# EAGLE design CalibratorDevice (EAGLE 7.7.0)
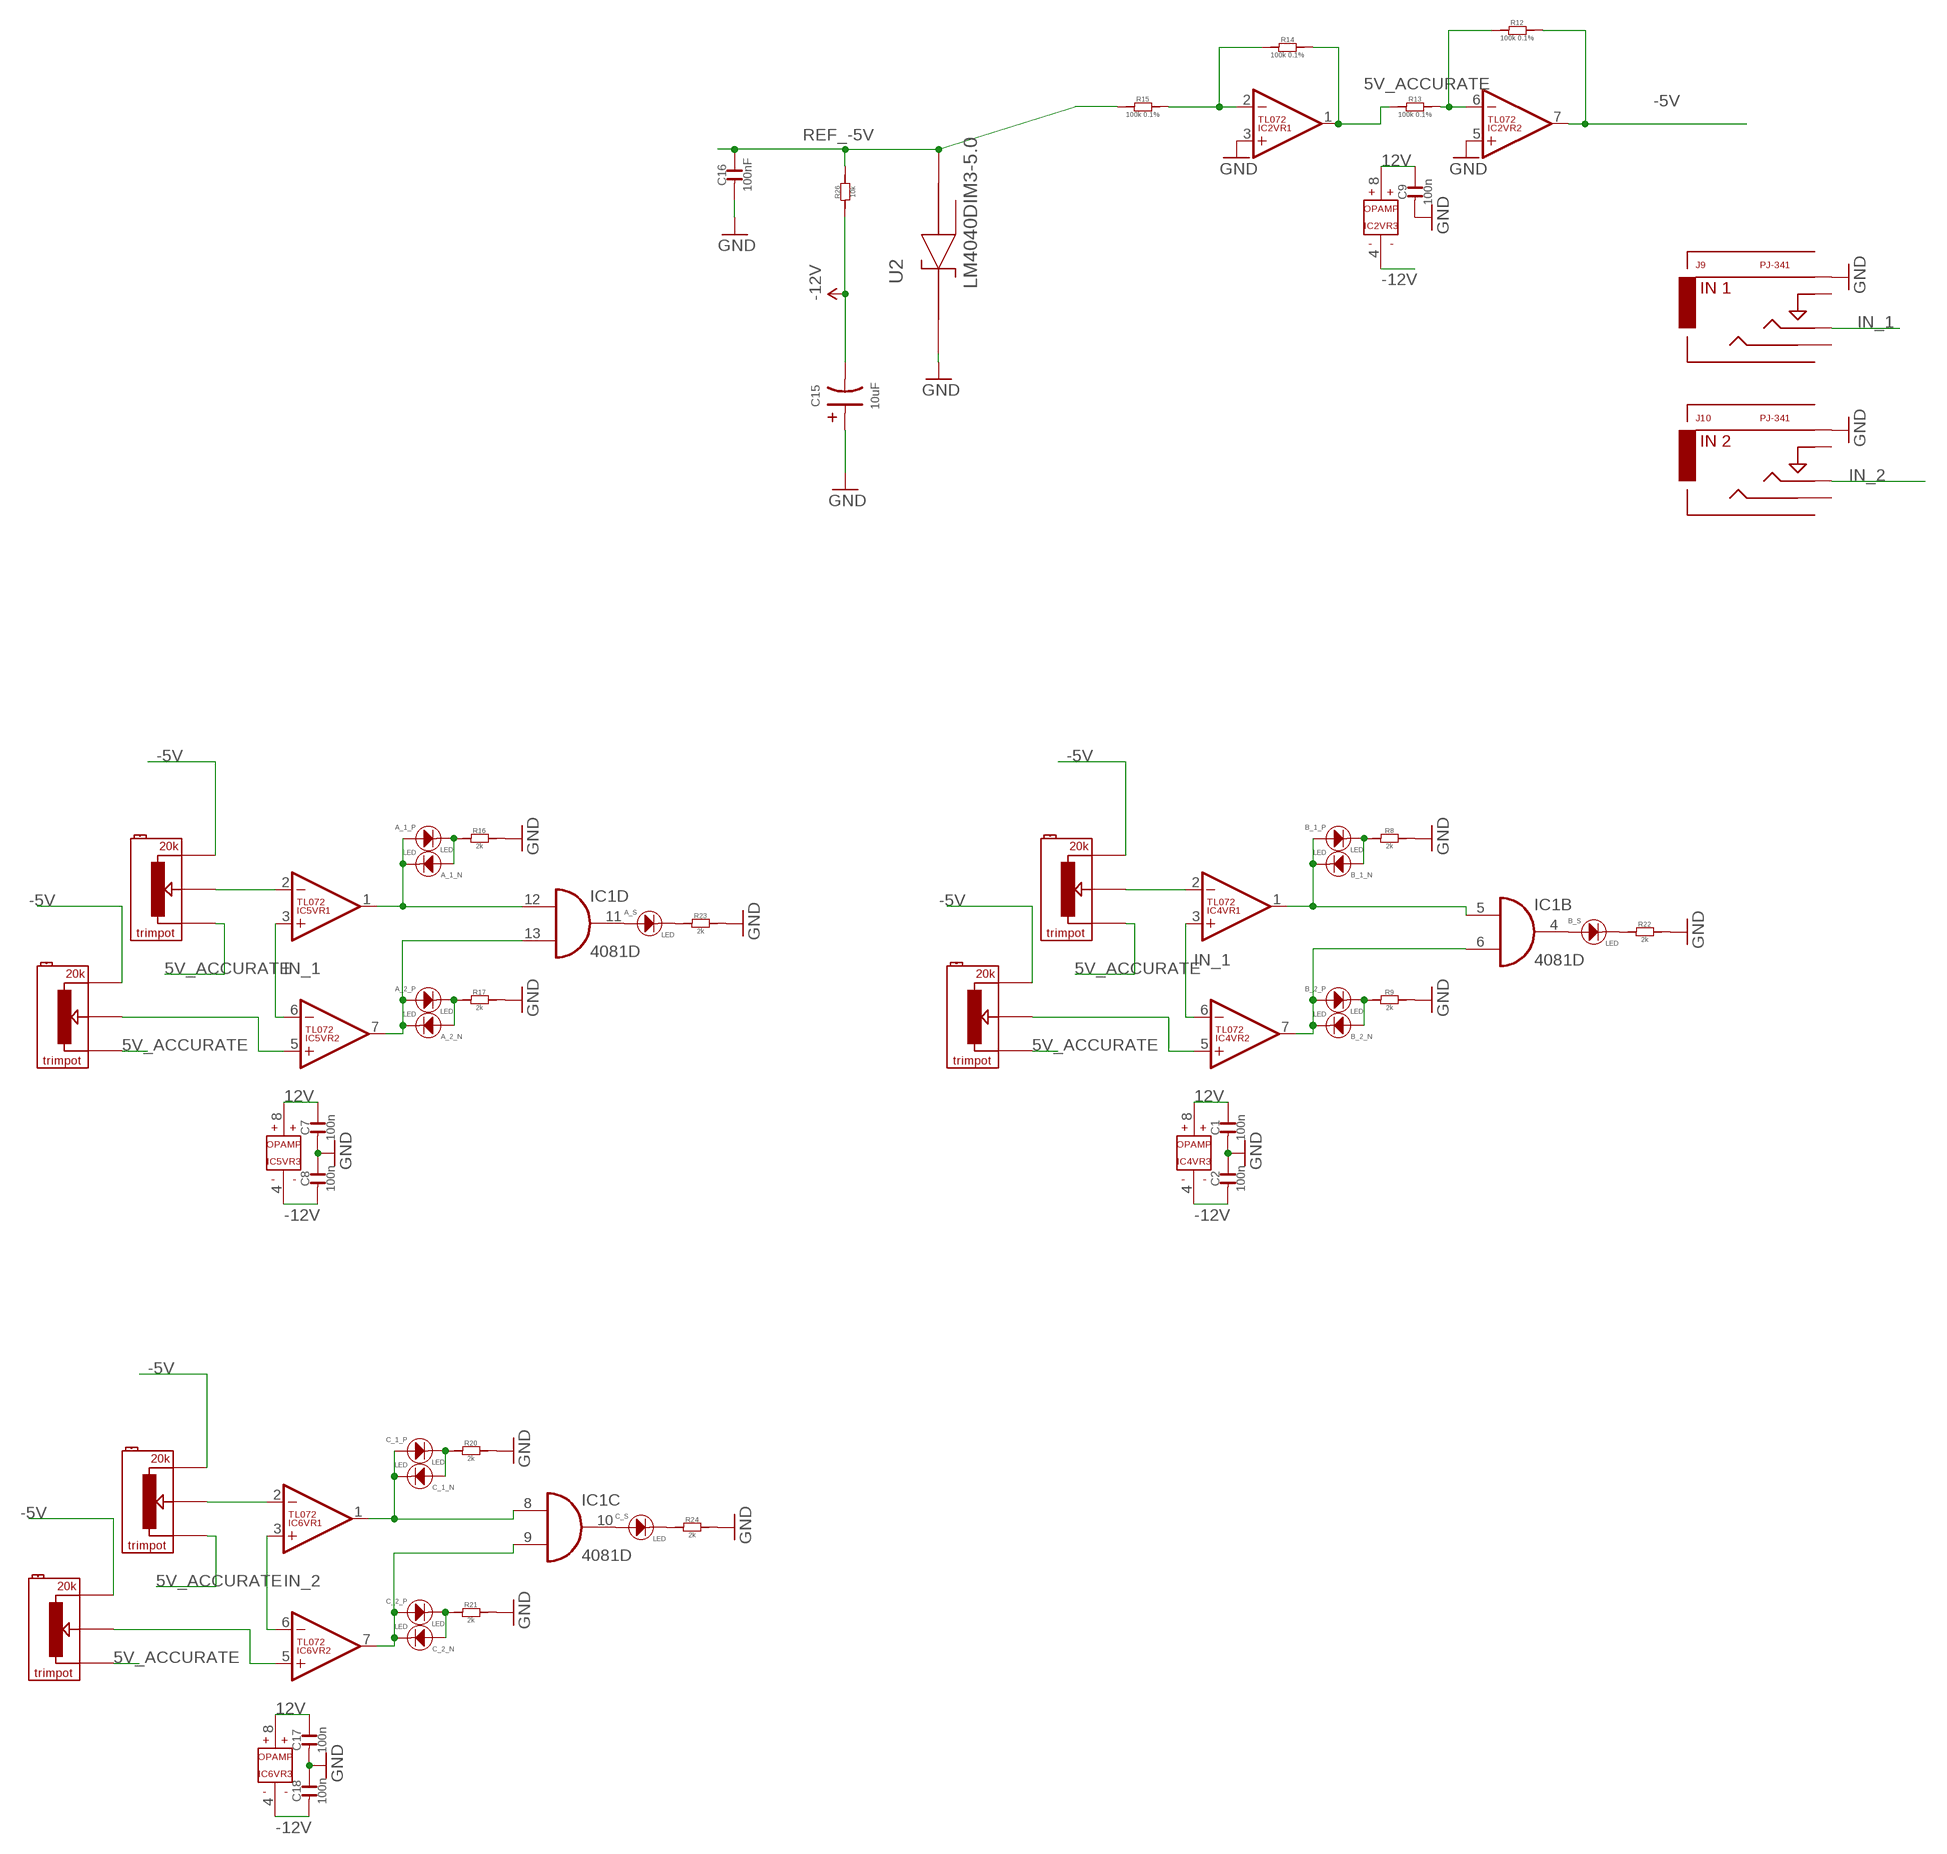
[diagram p0: schematic, sheet 1, part 1 of 2]
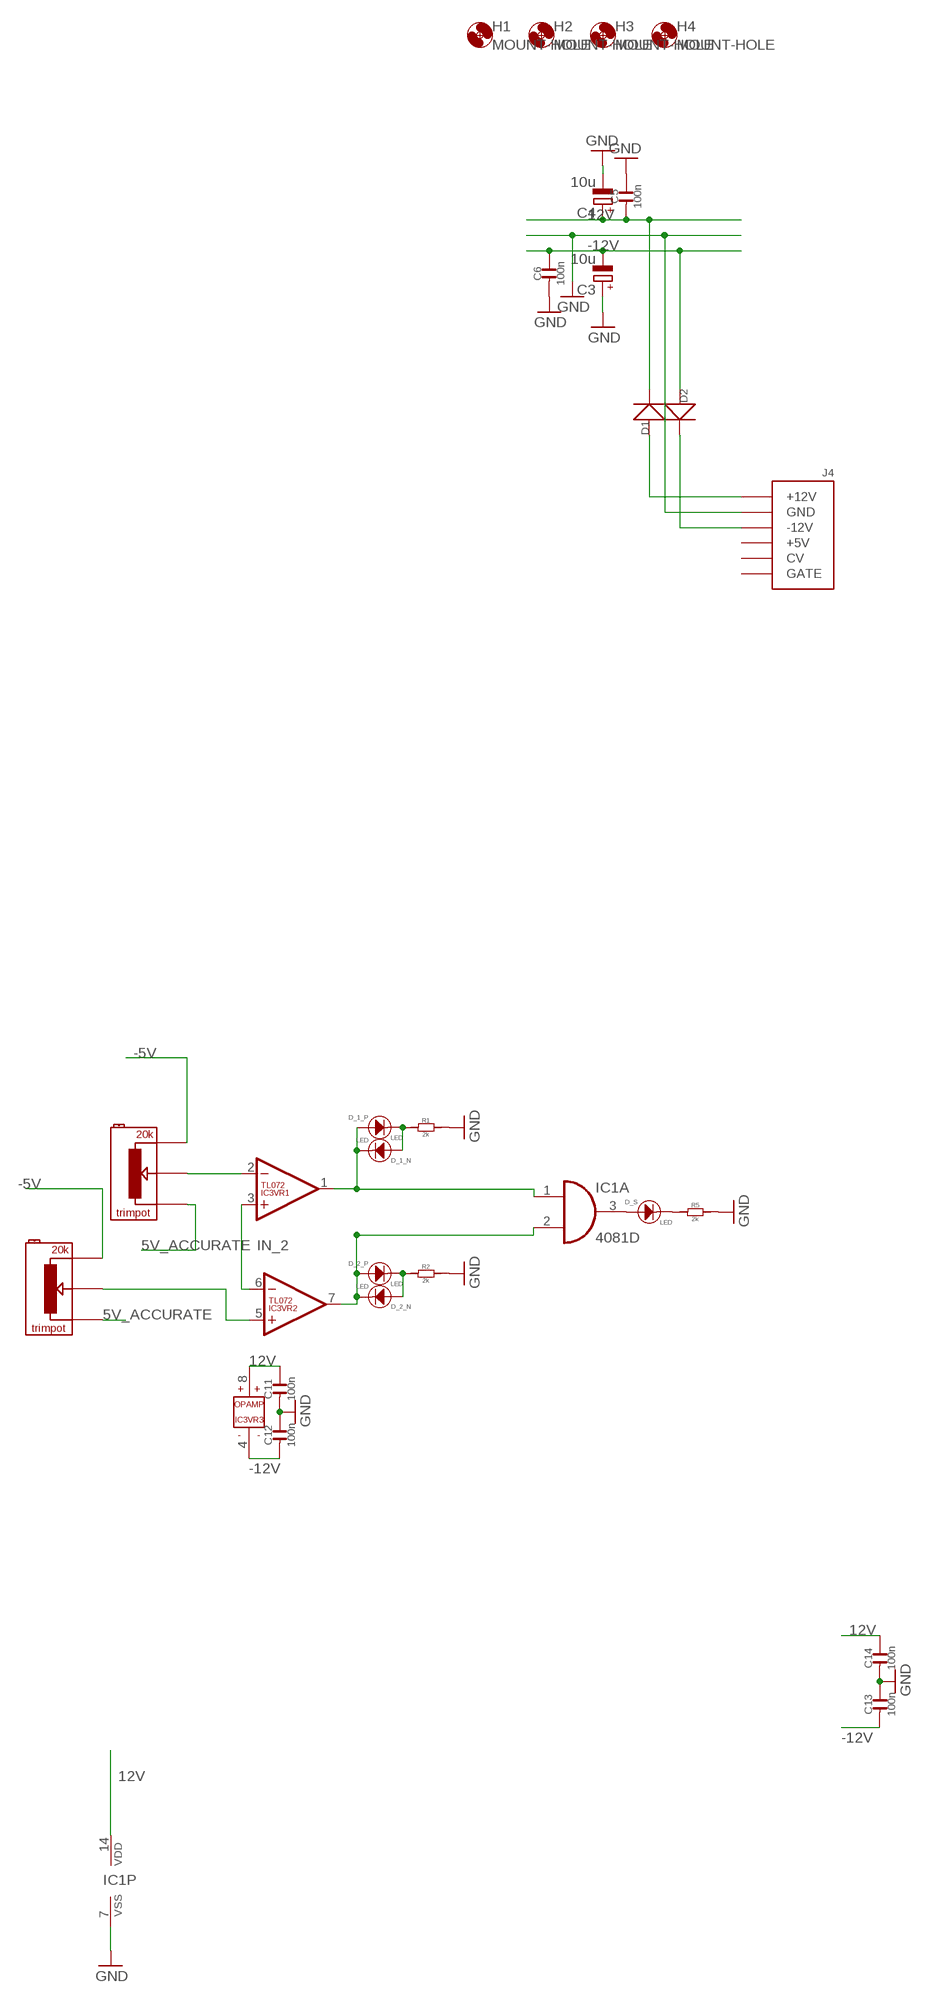
[diagram p1: schematic, sheet 1, part 2 of 2]

## Parts
A_1_N  LED  LED3MM  [3MMLED]
A_1_P  LED  LED3MM  [3MMLED]
A_2_N  LED  LED3MM  [3MMLED]
A_2_P  LED  LED3MM  [3MMLED]
A_NEG  20k  TRIMPOT  [TRIMPOT]
A_POS  20k  TRIMPOT  [TRIMPOT]
A_S  LED  LED3MM  [3MMLED]
B_1_N  LED  LED3MM  [3MMLED]
B_1_P  LED  LED3MM  [3MMLED]
B_2_N  LED  LED3MM  [3MMLED]
B_2_P  LED  LED3MM  [3MMLED]
B_NEG  20k  TRIMPOT  [TRIMPOT]
B_POS  20k  TRIMPOT  [TRIMPOT]
B_S  LED  LED3MM  [3MMLED]
C1  100n  C-0603  [C0603]
C2  100n  C-0603  [C0603]
C3  10u  CAPACITOR_POL-CASE_B  [CASE_B]
C4  10u  CAPACITOR_POL-CASE_B  [CASE_B]
C5  100n  C-0603  [C0603]
C6  100n  C-0603  [C0603]
C7  100n  C-0603  [C0603]
C8  100n  C-0603  [C0603]
C9  100n  C-0603  [C0603]
C11  100n  C-0603  [C0603]
C12  100n  C-0603  [C0603]
C13  100n  C-0603  [C0603]
C14  100n  C-0603  [C0603]
C15  10uF  C-POLAR-A  [CASE-A_3216]
C16  100nF  C-0603  [C0603]
C17  100n  C-0603  [C0603]
C18  100n  C-0603  [C0603]
C_1_N  LED  LED3MM  [3MMLED]
C_1_P  LED  LED3MM  [3MMLED]
C_2_N  LED  LED3MM  [3MMLED]
C_2_P  LED  LED3MM  [3MMLED]
C_NEG  20k  TRIMPOT  [TRIMPOT]
C_POS  20k  TRIMPOT  [TRIMPOT]
C_S  LED  LED3MM  [3MMLED]
D1  D-SMA  [DO-214AC]
D2  D-SMA  [DO-214AC]
D_1_N  LED  LED3MM  [3MMLED]
D_1_P  LED  LED3MM  [3MMLED]
D_2_N  LED  LED3MM  [3MMLED]
D_2_P  LED  LED3MM  [3MMLED]
D_NEG  20k  TRIMPOT  [TRIMPOT]
D_POS  20k  TRIMPOT  [TRIMPOT]
D_S  LED  LED3MM  [3MMLED]
H1  MOUNT-HOLE  [3.2-NOMARKINGS-SMALLSAFEZONE]
H2  MOUNT-HOLE  [3.2-NOMARKINGS-SMALLSAFEZONE]
H3  MOUNT-HOLE  [3.2-NOMARKINGS-SMALLSAFEZONE]
H4  MOUNT-HOLE  [3.2-NOMARKINGS-SMALLSAFEZONE]
IC1  4081D  [SO14]
IC2  TL072  [SO08]
IC3  TL072  [SO08]
IC4  TL072  [SO08]
IC5  TL072  [SO08]
IC6  TL072  [SO08]
J4  POWER_SHROUDED_NOTEXT  [POWER_16_SHROUDED_NOTEXT]
J9  PJ-341  AUDIO-JACKINPUT  [3.5MM-JACK-SWITCH-13MM-INPUT]
J10  PJ-341  AUDIO-JACKINPUT  [3.5MM-JACK-SWITCH-13MM-INPUT]
R1  2k  R-0603  [R0603]
R2  2k  R-0603  [R0603]
R5  2k  R-0603  [R0603]
R8  2k  R-0603  [R0603]
R9  2k  R-0603  [R0603]
R12  100k 0.1%  R-0603  [R0603]
R13  100k 0.1%  R-0603  [R0603]
R14  100k 0.1%  R-0603  [R0603]
R15  100k 0.1%  R-0603  [R0603]
R16  2k  R-0603  [R0603]
R17  2k  R-0603  [R0603]
R20  2k  R-0603  [R0603]
R21  2k  R-0603  [R0603]
R22  2k  R-0603  [R0603]
R23  2k  R-0603  [R0603]
R24  2k  R-0603  [R0603]
R26  10k  R-0603  [R0603]
U2  LM4040DIM3-5.0  [SOT95P237X112-3N]

## Nets
5V_ACCURATE: A_NEG.P$1 A_POS.P$1 B_NEG.P$1 B_POS.P$1 C_NEG.P$1 C_POS.P$1 D_NEG.P$1 D_POS.P$1 IC2.1(VR1:OUT) R13.1 R14.2
12V: C1.2 C4.+ C5.1 C7.2 C9.2 C11.2 C14.2 C17.2 D1.2(-) IC1.14(P:VDD) IC2.8(VR3:V+) IC3.8(VR3:V+) IC4.8(VR3:V+) IC5.8(VR3:V+) IC6.8(VR3:V+)
-5V: A_NEG.P$3 A_POS.P$3 B_NEG.P$3 B_POS.P$3 C_NEG.P$3 C_POS.P$3 D_NEG.P$3 D_POS.P$3 IC2.7(VR2:OUT) R12.2
-12V: C2.1 C3.- C6.2 C8.1 C12.1 C13.1 C15.- C18.1 D2.1(+) IC2.4(VR3:V-) IC3.4(VR3:V-) IC4.4(VR3:V-) IC5.4(VR3:V-) IC6.4(VR3:V-) R26.1
GND: C1.1 C2.2 C3.+ C4.- C5.2 C6.1 C7.1 C8.2 C9.1 C11.1 C12.2 C13.2 C14.1 C15.+ C16.1 C17.1 C18.2 IC1.7(P:VSS) IC2.3(VR1:+IN) IC2.5(VR2:+IN) J4.3(GND) J4.4(GND) J4.5(GND) J4.6(GND) J4.7(GND) J4.8(GND) J9.RING@3(RING) J10.RING@3(RING) R1.2 R2.2 R5.2 R8.2 R9.2 R16.2 R17.2 R20.2 R21.2 R22.2 R23.2 R24.2 U2.1(CATHODE)
IN_1: IC4.3(VR1:+IN) IC4.6(VR2:-IN) IC5.3(VR1:+IN) IC5.6(VR2:-IN) J9.TIP@3(TIP)
IN_2: IC3.3(VR1:+IN) IC3.6(VR2:-IN) IC6.3(VR1:+IN) IC6.6(VR2:-IN) J10.TIP@3(TIP)
N$1: D_1_N.+ D_1_P.- R1.1
N$2: D_NEG.P$2 IC3.2(VR1:-IN)
N$3: IC2.2(VR1:-IN) R14.1 R15.2
N$4: D_2_N.+ D_2_P.- R2.1
N$5: D_POS.P$2 IC3.5(VR2:+IN)
N$6: D_2_N.- D_2_P.+ IC1.2(A:I1) IC3.7(VR2:OUT)
N$7: IC2.6(VR2:-IN) R12.1 R13.2
N$8: D1.1(+) J4.9(+12V) J4.10(+12V)
N$9: D_1_N.- D_1_P.+ IC1.1(A:I0) IC3.1(VR1:OUT)
N$10: D_S.+ IC1.3(A:O)
N$11: D_S.- R5.1
N$12: B_1_N.- B_1_P.+ IC1.5(B:I0) IC4.1(VR1:OUT)
N$13: B_NEG.P$2 IC4.2(VR1:-IN)
N$14: B_1_N.+ B_1_P.- R8.1
N$15: B_2_N.+ B_2_P.- R9.1
N$16: B_2_N.- B_2_P.+ IC1.6(B:I1) IC4.7(VR2:OUT)
N$17: D2.2(-) J4.1(-12V) J4.2(-12V)
N$18: B_POS.P$2 IC4.5(VR2:+IN)
N$19: A_1_N.- A_1_P.+ IC1.12(D:I0) IC5.1(VR1:OUT)
N$20: A_NEG.P$2 IC5.2(VR1:-IN)
N$21: A_1_N.+ A_1_P.- R16.1
N$22: A_2_N.+ A_2_P.- R17.1
N$23: A_2_N.- A_2_P.+ IC1.13(D:I1) IC5.7(VR2:OUT)
N$25: A_POS.P$2 IC5.5(VR2:+IN)
N$26: C_1_N.- C_1_P.+ IC1.8(C:I0) IC6.1(VR1:OUT)
N$27: C_NEG.P$2 IC6.2(VR1:-IN)
N$28: C_1_N.+ C_1_P.- R20.1
N$29: C_2_N.+ C_2_P.- R21.1
N$30: C_2_N.- C_2_P.+ IC1.9(C:I1) IC6.7(VR2:OUT)
N$32: C_POS.P$2 IC6.5(VR2:+IN)
N$33: B_S.- R22.1
N$34: A_S.- R23.1
N$35: C_S.- R24.1
N$36: B_S.+ IC1.4(B:O)
N$37: A_S.+ IC1.11(D:O)
N$38: C_S.+ IC1.10(C:O)
REF_-5V: C16.2 R15.1 R26.2 U2.2(ANODE)
Unconnected: J4.11(+5V) J4.12(+5V) J4.13(CV) J4.14(CV) J4.15(GATE) J4.16(GATE) J9.SECOND@3(SECOND) J9.SWITCH@3(SWITCH) J10.SECOND@3(SECOND) J10.SWITCH@3(SWITCH) U2.3(NC)

## Library data of the parts
A_1_N A_1_P A_2_N A_2_P A_S B_1_N B_1_P B_2_N B_2_P B_S C_1_N C_1_P C_2_N C_2_P C_S D_1_N D_1_P D_2_N D_2_P D_S = EurorackModularParts:LED*: LED
A_NEG A_POS B_NEG B_POS C_NEG C_POS D_NEG D_POS = EurorackModularParts:TRIMPOT
C1 C2 C5-C9 C11-C14 C17 C18 = OPL:C*
C3 C4 = dp_devices:CAPACITOR_POL: Polarized capacitor in various packages
C15 = EurorackModularParts:C-POLAR*; MF: AVX; MPN: TAJB106K020RNJ; OC_FARNELL: 197427
C16 = OPL:C*; MF: AVX; MPN: 06035C104KAT2A; OC_FARNELL: 1301804
D1 D2 = OPL:D*: DIODE
H1-H4 = zephod-components:MOUNT-HOLE: MOUNTING HOLE with drill center marker
IC1 = 40xx:4081: Quad 2-input AND
IC2-IC6 = EurorackModularParts:TL072
J4 = EurorackModularParts:POWER
J9 = EurorackModularParts:AUDIO-JACK: Switching Mono 3.5mm Audio Jack from Erthenvar.; DESC: IN 1; MPN: PJ-341
J10 = EurorackModularParts:AUDIO-JACK: Switching Mono 3.5mm Audio Jack from Erthenvar.; DESC: IN 2; MPN: PJ-341
R1 R2 R5 R8 R9 R12-R17 R20-R24 = OPL:R*
R26 = OPL:R*; OC_FARNELL: unknown
U2 = FarnellThings:LM4040DIM3-5.0: IC, Precision Micropower Shunt Voltage Reference, 5V,SOT-23-3; MF: TEXAS INSTRUMENTS; MPN: LM4040DIM3-5.0; OC_FARNELL: 9778330; OC_NEWARK: 97K3489; PACKAGE: SOT-23-3; SUPPLIER: TEXAS INSTRUMENTS

## Net classes
0 default: width 0.305 mm, clearance 0.178 mm
1 heavypower: width 0.381 mm
3 groundplane: width 0.178 mm, clearance 0.178 mm

## Board
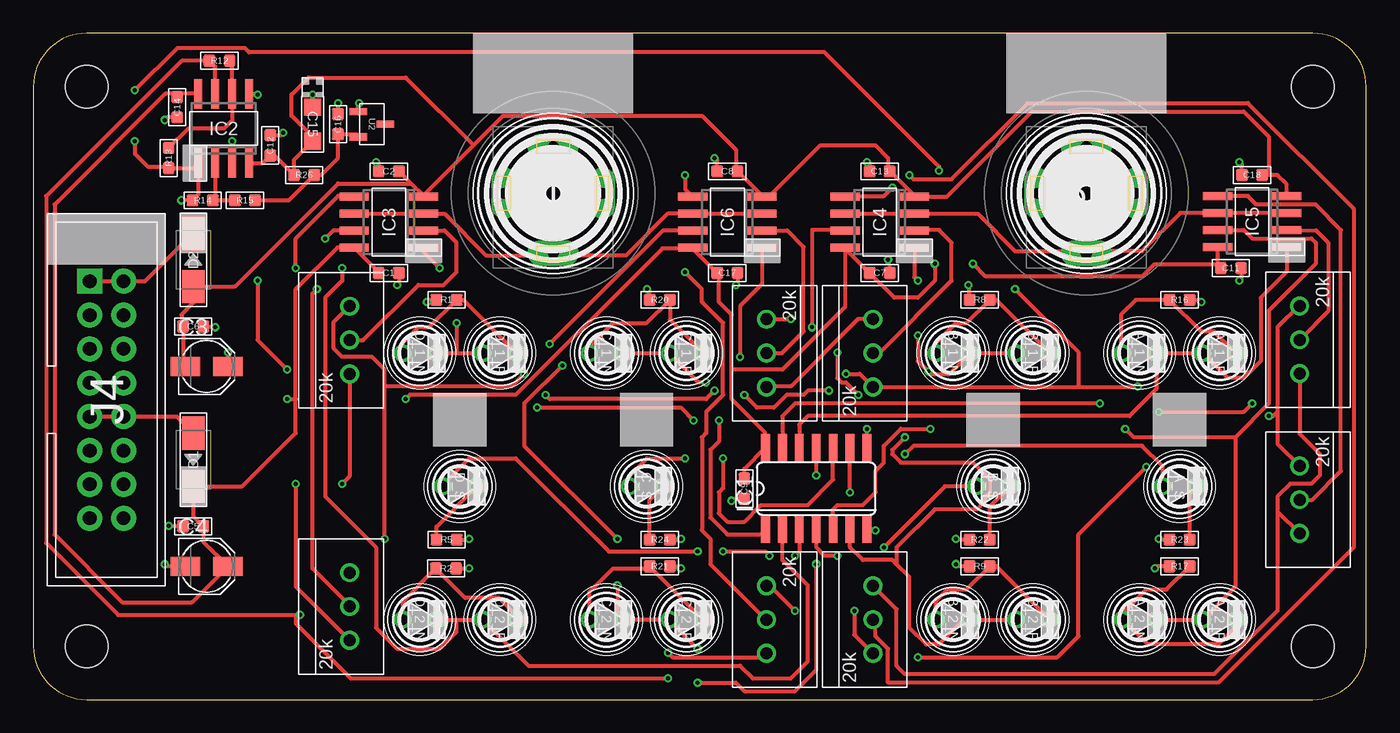
[diagram p2: board, top side]
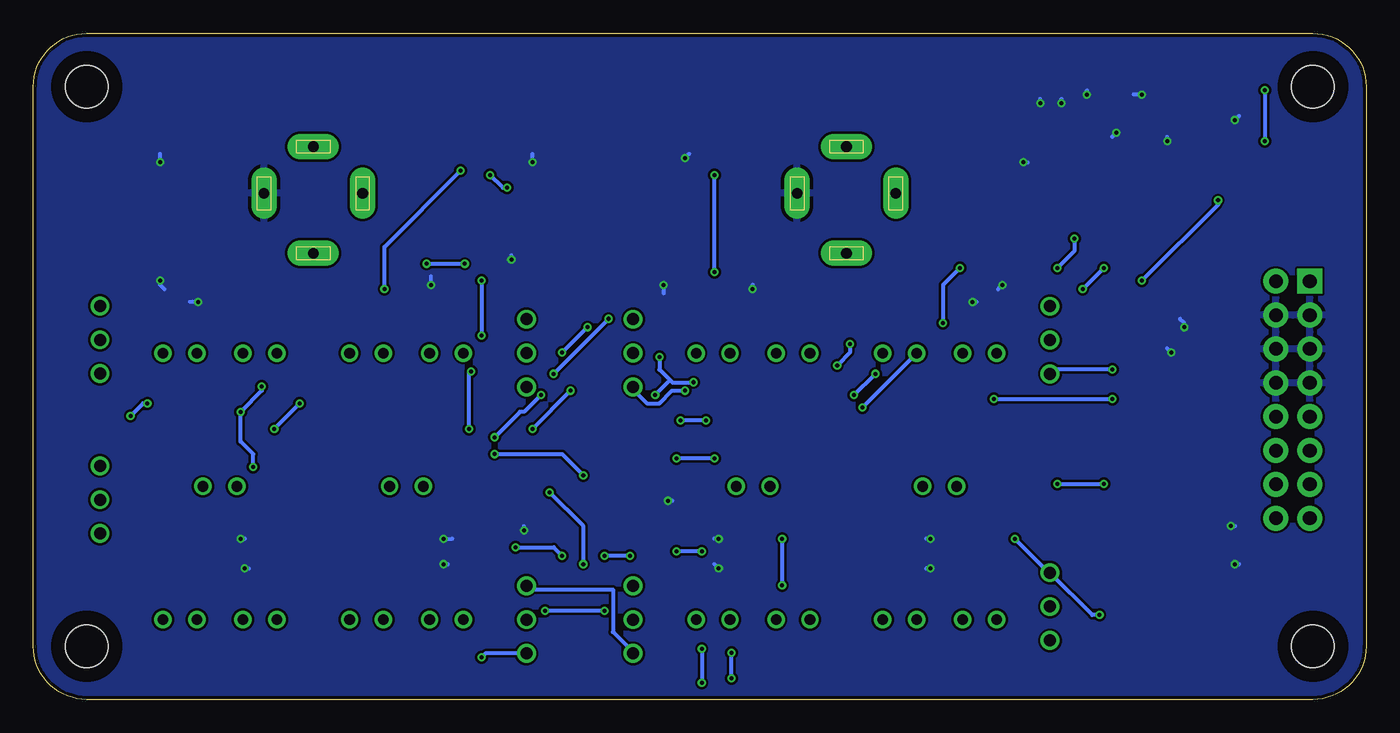
[diagram p3: board, bottom side, seen from below]

Size 100 x 50 mm. Coordinates in mm from the lower left corner, seen from the top.
Outline: 0,46 0,4 arc90 4,0 96,0 arc90 100,4 100,46 arc90 96,50 4,50 arc90 0,46
Copper layers (1*16): Top 0.035mm / dielectric 1.5mm / Bottom 0.035mm
Design rules "ITEADstudio_DRC": minimum track width 6mil, minimum drill 12mil, track to track 6mil, track to pad 6mil, pad to pad 6mil, via to via 6mil, smd to smd 0mil, copper to edge 10mil, drill to drill 10mil, minimum pad ring 10mil, minimum via ring 6mil, stop-mask expansion 2mil, vias tented up to drill 100mil, thermal gap 10mil

### Footprints (pad centres in the part's own frame; a part is rotated, then mirrored left to right if it is on the bottom)
3MMLED = drill 0.8: + -1.27,0; - 1.27,0
TRIMPOT = drill 0.9: P$1 -2.54,0; P$2 0,0; P$3 2.54,0
C0603 = smd 0.889 x 0.889: 1 -0.762,0; 2 0.762,0
CASE_B = smd 2.2 x 1.4: + 1.6,0; - -1.6,0
CASE-A_3216 = smd 1.27 x 1.27: + -1.27,0; - 1.27,0
DO-214AC = smd 2.5 x 1.7: 1 -2,0; 2 2,0
3.2-NOMARKINGS-SMALLSAFEZONE = hole 3.2: 0,0
SO14 = smd 0.66 x 2.032: 1 -3.81,-3.073; 2 -2.54,-3.073; 3 -1.27,-3.073; 4 0,-3.073; 5 1.27,-3.073; 6 2.54,-3.073; 7 3.81,-3.073; 8 3.81,3.073; 9 2.54,3.073; 10 1.27,3.073; 11 0,3.073; 12 -1.27,3.073; 13 -2.54,3.073; 14 -3.81,3.073
SO08 = smd 0.6 x 2.2: 1 -1.905,-2.6; 2 -0.635,-2.6; 3 0.635,-2.6; 4 1.905,-2.6; 5 1.905,2.6; 6 0.635,2.6; 7 -0.635,2.6; 8 -1.905,2.6
POWER_16_SHROUDED_NOTEXT = drill 1.016 pad 1.88 square: 1 -8.89,-1.27 | drill 1.016 pad 1.88: 2 -8.89,1.27; 3 -6.35,-1.27; 4 -6.35,1.27; 5 -3.81,-1.27; 6 -3.81,1.27; 7 -1.27,-1.27; 8 -1.27,1.27; 9 1.27,-1.27; 10 1.27,1.27; 11 3.81,-1.27; 12 3.81,1.27; 13 6.35,-1.27; 14 6.35,1.27; 15 8.89,-1.27; 16 8.89,1.27
3.5MM-JACK-SWITCH-13MM-INPUT = drill 0.8 pad 1.93 long: RING@3 -3.7,0; SECOND@3 0,-3.5; SWITCH@3 3.7,0; TIP@3 0,4.5
R0603 = smd 0.889 x 0.889: 1 -0.762,0; 2 0.762,0
SOT95P237X112-3N = smd 1.321 x 0.559: 1 -1.016,0.94; 2 -1.016,-0.94; 3 1.016,0

### Placement (x,y rotation side)
A_1_N  83,26 0 top
A_1_P  89,26 0 top
A_2_N  83,6 0 top
A_2_P  89,6 0 top
A_NEG  95,27 270 top
A_POS  95,15 270 top
A_S  86,16 0 top
B_1_N  69,26 0 top
B_1_P  75,26 0 top
B_2_N  69,6 0 top
B_2_P  75,6 0 top
B_NEG  63,26 90 top
B_POS  63,6 90 top
B_S  72,16 0 top
C1  26.67,32.02 180 top
C2  26.67,39.64 180 top
C3  13,25 0 top
C4  13,10 0 top
C5  12,13 180 top
C6  12,28 180 top
C7  63.5,32.02 180 top
C8  52.07,39.64 180 top
C9  53.34,15.83 90 top
C11  89.85,32.38 180 top
C12  17.78,41.59 90 top
C13  63.5,39.64 180 top
C14  10.79,44.45 90 top
C15  20.95,43.18 270 top
C16  22.86,43.18 270 top
C17  52.07,32.02 180 top
C18  91.44,39.37 180 top
C_1_N  43,26 0 top
C_1_P  49,26 0 top
C_2_N  43,6 0 top
C_2_P  49,6 0 top
C_NEG  55,26 270 top
C_POS  55,6 270 top
C_S  46,16 0 top
D1  12,18 270 top
D2  12,33 90 top
D_1_N  29,26 0 top
D_1_P  35,26 0 top
D_2_N  29,6 0 top
D_2_P  35,6 0 top
D_NEG  23.73,26.98 90 top
D_POS  23.73,6.98 90 top
D_S  32,16 0 top
H1  4,4 0 top
H2  96,4 0 top
H3  96,46 0 top
H4  4,46 0 top
IC1  58.74,15.83 0 top
IC2  14.29,42.86 0 top
IC3  26.67,35.83 90 top
IC4  63.5,35.83 90 top
IC5  91.44,35.88 90 top
IC6  52.07,35.83 90 top
J4  5.5,22.5 270 top
J9  79,38 180 top
J10  39,38 180 top
R1  31,30 180 top
R2  30.96,9.83 0 top
R5  31,12 0 top
R8  71,30 180 top
R9  71,10 180 top
R12  13.97,47.94 180 top
R13  10.16,40.64 90 top
R14  12.7,37.47 180 top
R15  15.88,37.47 180 top
R16  86,30 0 top
R17  86,10 180 top
R20  47,30 180 top
R21  47,10 0 top
R22  71,12 180 top
R23  86,12 180 top
R24  47,12 0 top
R26  20.32,39.37 0 top
U2  25.4,43.18 0 top

### Tracks (layer width: path | path; a pad name or v marks a point on that pad's centre or on a via)
5V_ACCURATE  (via drill 0.3)
  Top 0.305: D_NEG.P$1 23.73,16.75 v23.18,16.19 | v19.68,16.19 19.68,8.48 D_POS.P$1 | A_NEG.P$1 94.94,29.54 93.34,27.94 93.34,21.59 | 93.34,21.59 93.34,19.2 A_POS.P$1 | C_NEG.P$1 56.8,28.54 v56.83,28.57 | v60.96,24.45 62.01,24.45 B_NEG.P$1 78.43,23.46 | 78.43,23.46 82.83,23.46 v82.87,23.5 | v84.45,21.59 90.81,21.59 v91.44,22.23 | v92.71,21.27 93.03,21.27 93.34,21.59 | C_POS.P$1 55.28,8.54 v57.15,6.67 | v61.59,6.67 61.59,4.87 B_POS.P$1 | v11.11,37.47 R14.2 12.38,37.91 IC2.1 12,39.88 R13.1 10.03,40.01 8.57,40.01 7.62,40.96 v7.62,41.91 | v16.83,31.43 16.83,26.99 v19.05,24.77 | v66.36,3.17 76.83,3.17 78.42,4.76 78.42,12.38 v83.5,17.46 | 78.43,23.46 78.43,26.03 v73.66,30.8 | v67.94,39.69 67.94,40.01 59.37,48.58 16.19,48.58 15.88,48.9 10.79,48.9 v7.62,45.72
  Bottom 0.305: v23.18,16.19 v19.68,16.19 | v56.83,28.57 v60.96,24.45 | v82.87,23.5 82.87,23.18 v84.45,21.59 84.45,19.37 83.5,18.41 v83.5,17.46 | v91.44,22.23 91.76,22.23 v92.71,21.27 | v57.15,6.67 v61.59,6.67 | v11.11,37.47 11.11,37.15 v16.83,31.43 | v19.05,24.77 23.41,24.77 D_NEG.P$1 | B_POS.P$1 66.07,3.46 v66.36,3.17 | v73.66,30.8 73.66,33.97 v67.94,39.69 | v7.62,45.72 v7.62,41.91
12V  (via drill 0.3)
  Top 0.305: IC5.8 88.84,32.64 | 88.84,32.64 C11.2 | IC6.8 49.47,33.86 | 49.47,33.86 C17.2 51.44,31.89 51.44,29.84 52.39,28.89 52.39,24.77 | IC4.8 60.9,33.86 | 60.9,33.86 C7.2 64.6,30.16 66.36,30.16 67.63,31.43 v67.63,32.7 | C14.2 11.05,45.46 IC2.8 9.9,45.46 1.59,37.15 1.59,12.38 6.67,7.3 11.9,7.3 C4.+ 12.76,11.84 C5.1 12,13.76 D1.2 15.68,16 19.68,20 19.68,22.54 | 19.68,22.54 19.68,30.8 22.81,33.92 IC3.8 25.91,32.09 C1.2 | 52.39,24.77 52.39,22.54 54.93,20 IC1.14 53.34,17.31 C9.2 | 49.47,33.86 47.19,33.86 36.2,22.86 28.26,22.86 v27.94,22.54 | v19.05,22.54 19.68,22.54 | 60.9,33.86 60.9,29.47 56.2,24.77 52.39,24.77 | 88.84,32.64 84.07,32.64 83.19,31.75 71.44,31.75 v70.48,32.7
  Bottom 0.305: v27.94,22.54 v19.05,22.54 | v70.48,32.7 v67.63,32.7
-5V  (via drill 0.3)
  Top 0.305: IC2.7 13.65,47.5 R12.2 11.11,47.94 0.95,37.78 0.95,11.75 6.35,6.35 19.68,6.35 | A_NEG.P$3 95,19.93 96.52,18.41 96.52,16.83 95.89,16.19 94.3,16.19 93.34,15.24 93.34,14.12 | 93.34,14.12 A_POS.P$3 | v26.35,12.06 26.35,23.5 | 26.35,23.5 26.35,24.77 25.4,25.72 23.18,25.72 22.54,26.35 22.54,28.33 D_NEG.P$3 | B_NEG.P$3 61.88,28.54 56.83,23.5 55.03,23.5 C_NEG.P$3 | B_POS.P$3 64.77,6.77 64.77,2.54 65.41,1.91 88.58,1.91 93.34,6.67 93.34,14.12 | 19.68,6.35 v20,6.35 | 19.68,6.35 19.68,5.71 23.81,1.59 v47.62,1.59 | v47.62,3.49 47.94,3.17 54.61,3.17 | 54.61,3.17 54.72,3.17 | 26.35,23.5 35.88,23.5 v36.83,24.45 | v38.42,22.86 38.73,22.54 50.48,22.54 v51.12,23.18 | 54.61,3.17 C_POS.P$3
  Bottom 0.305: v26.35,12.06 23.81,9.52 D_POS.P$3 20.56,6.35 v20,6.35 | v47.62,1.59 v47.62,3.49 | v38.42,22.86 v36.83,24.45 | v51.12,23.18 52.07,23.18 53.02,22.23 53.98,22.23 54.93,23.18 C_NEG.P$3 | C_POS.P$3 55.24,3.81 56.52,5.08 56.52,8.26 62.87,8.26 B_POS.P$3
-12V
  Top 0.305: C3.- 11.24,25.16 C6.2 11.11,28.12 11.11,28.89 12,29.78 D2.1 15.12,31 22.86,38.73 28.34,38.73 | IC5.4 94.04,38.67 93.34,39.37 92.71,39.37 | 92.71,39.37 C18.1 | IC6.4 54.67,37.8 | 54.67,37.8 C8.1 52.7,39.77 52.7,41.27 50.16,43.81 35.24,43.81 33.02,41.59 | 92.71,39.37 92.71,42.23 90.81,44.13 74.93,44.13 68.53,37.73 IC4.4 66.1,37.8 C13.1 64.14,39.77 64.14,40.64 63.18,41.59 59.05,41.59 55.26,37.8 54.67,37.8 | 33.02,41.59 29.27,37.84 IC3.4 29.27,37.8 28.34,38.73 | 28.34,38.73 C2.1 | 33.02,41.59 27.94,46.67 20.64,46.67 19.37,45.4 19.37,43.81 20.95,42.23 C15.- 19.56,40.51 R26.1 18.1,40.83 C12.1 17.21,40.26 IC2.4
GND  (via drill 0.3)
  Top 0.305: C6.1 13.59,28 v13.65,27.94 | C3.+ v14.6,26.03 v14.61,26.04 | C14.1 10.03,43.69 v9.84,43.5 | IC2.5 16.77,45.46 v16.83,45.4 | C12.2 18.54,42.35 v18.73,42.55 | C15.+ v20.95,45.4 | C16.1 v22.86,44.77 | U2.1 24.38,44.7 v24.45,44.77 | C2.2 25.91,40.13 v25.72,40.32 | C1.1 27.43,31.24 v27.3,31.11 | R1.2 29.68,30 v29.53,29.84 | R20.2 46.24,30.6 v46.04,30.8 | C5.2 10.18,13 v10.16,13.02 | C4.- 10,10 v9.84,10.16 | R2.2 v32.69,9.83 v32.7,9.84 | R5.2 32.64,12 v32.7,12.06 | R24.2 48.51,12 v48.58,12.06 | R21.2 48.42,10 v48.58,9.84 | C9.1 52.53,15.07 v52.39,14.92 | R17.2 84.3,10 v84.14,9.84 | R23.2 84.52,12 v84.45,12.06 | R22.2 69.28,12 v69.22,12.06 | R9.2 69.38,10 v69.22,10.16 | R8.2 70.24,31.04 v70.17,31.11 | R16.2 87.47,30 v87.63,29.84 | C18.2 90.68,40.13 v90.49,40.32 | C11.1 90.61,31.56 v90.49,31.43 | C8.2 51.31,40.45 v51.12,40.64 | C17.1 52.83,31.24 v52.7,31.11 | C13.2 62.74,40.13 v62.55,40.32 | C7.1 64.26,32.58 64.14,32.7 v64.14,33.02 | IC2.3 v14.92,41.91 | IC1.7 63.18,12.75 v63.18,12.7
  Bottom 0.305: v13.65,27.94 13.65,28.26 13.97,28.57 | v14.61,26.04 14.92,26.35 | v9.84,43.5 9.53,43.81 | v16.83,45.4 17.46,45.4 | v18.73,42.55 19.05,42.23 | v20.95,45.4 20.95,45.72 | v22.86,44.77 22.86,45.09 | v24.45,44.77 24.45,45.09 | v25.72,40.32 25.4,40.32 | v27.3,31.11 27.62,30.8 | v29.53,29.84 29.21,29.84 | v46.04,30.8 46.04,31.11 | v10.16,13.02 9.84,13.02 | v9.84,10.16 9.53,10.16 | v32.7,9.84 33.02,9.84 | v32.7,12.06 33.02,12.06 | v48.58,12.06 48.9,12.06 | v48.58,9.84 48.9,10.16 | v52.39,14.92 52.07,14.92 | v84.14,9.84 83.82,9.84 | v84.45,12.06 84.14,12.06 | v69.22,12.06 68.58,12.06 | v69.22,10.16 68.9,10.16 | v70.17,31.11 70.17,31.75 | v87.63,29.84 88.27,29.84 | v90.49,40.32 90.49,40.96 | v90.49,31.43 90.49,31.11 90.17,30.8 | v51.12,40.64 50.8,40.96 | v52.7,31.11 52.7,30.48 | v62.55,40.32 62.55,40.96 | v64.14,33.02 64.14,33.34 | v14.92,41.91 14.92,42.23 | v63.18,12.7 63.18,13.02
  pour Bottom: 1.5,54.75 101.25,54.75 arc-90 97.25,-3.75 0.25,-2.75 arc-90 -3.75,1.25 -2.75,47.5 arc-90
IN_1
  Top 0.305: IC5.3 IC5.6 86.04,36.51 83.19,33.66 78.84,33.66 | IC4.6 IC4.3 70.85,36.47 73.66,33.66 78.84,33.66 | 78.84,33.66 J9.TIP@3
IN_2
  Top 0.305: IC6.3 IC6.6 47.58,36.47 44.45,33.34 39.16,33.34 J10.TIP@3 38.84,33.34 33.97,33.34 30.84,36.47 IC3.3 IC3.6
N$1
  Top 0.305: D_1_P.- 32.27,30 R1.1 29.7,27.94 28.89,27.94 27.73,26.78 D_1_N.+
N$2
  Top 0.305: D_NEG.P$2 24.76,26.98 28.89,31.11 30.8,31.11 31.75,32.07 31.75,34.29 30.84,35.2 IC3.2
N$3
  Top 0.305: IC2.2 13.65,37.66 R14.1 R15.2
N$4
  Top 0.305: D_2_P.- 36.27,6.28 34.92,7.62 32.41,7.62 R2.1 27.73,7.36 D_2_N.+
N$5  (via drill 0.3)
  Top 0.305: D_POS.P$2 23.73,7.07 20.95,9.84 20.95,30.48 v21.27,30.8 | v19.68,32.38 19.68,34.61 22.86,37.78 24.02,37.78 IC3.5
  Bottom 0.305: v21.27,30.8 v19.68,32.38
N$6  (via drill 0.3)
  Top 0.305: D_2_N.- 31.75,6 | 31.75,6 D_2_P.+ 33.73,5.96 37.15,2.54 53.02,2.54 53.98,1.59 56.83,1.59 58.1,2.86 58.1,8.57 56.2,10.48 IC1.2 | IC3.7 22.5,35.2 v21.91,34.61 | v23.18,32.38 23.18,31.43 21.91,30.16 21.91,15.24 25.72,11.43 25.72,5.4 27.3,3.81 30.48,3.81 31.75,5.08 31.75,6
  Bottom 0.305: v21.91,34.61 21.91,33.66 v23.18,32.38
N$7
  Top 0.305: R12.1 14.92,47.75 IC2.6 14.92,43.5 14.29,42.86 11.62,42.86 R13.2
N$8
  Top 0.305: J4.9 J4.10 10.77,21.23 D1.1
N$9  (via drill 0.3)
  Top 0.305: D_1_N.- 31.75,26 | 31.75,26 D_1_P.+ | IC3.1 29.27,33.59 v30.48,32.38 | v31.75,28.26 31.75,26 | v37.78,21.91 48.58,21.91 v49.53,20.95 | v51.44,20.95 51.44,19.37 50.8,18.73 50.8,13.65 52.07,12.38 54.56,12.38 IC1.1
  Bottom 0.305: v30.48,32.38 31.75,31.11 v31.75,28.26 | D_1_P.+ 33.73,25.96 v37.78,21.91 | v49.53,20.95 v51.44,20.95
N$10  (via drill 0.3)
  Top 0.305: D_S.+ 30.73,16.12 32.7,18.1 36.2,18.1 43.18,11.11 v49.85,11.11 | v51.75,11.11 54.93,11.11 v55.24,10.79 | IC1.3 57.47,11.11 v57.15,10.79
  Bottom 0.305: v49.85,11.11 v51.75,11.11 | v55.24,10.79 v57.15,10.79
N$11
  Top 0.305: R5.1 30.24,12.97 D_S.-
N$12  (via drill 0.3)
  Top 0.305: B_1_P.+ B_1_N.- 68.72,24.45 67.31,24.45 | IC4.1 66.1,31.69 v66.36,31.43 | v66.36,27.3 66.36,25.4 v67.15,24.61 | v67.15,24.61 67.31,24.45 | IC1.5 60.01,14.29 60.33,14.61 62.23,14.61 63.18,15.56 63.18,17.14 63.82,17.78 63.82,19.05 65.09,20.32 v67.31,20.32 | v67.15,24.61 67.47,24.61 67.31,24.45
  Bottom 0.305: v66.36,31.43 v66.36,27.3 | v67.31,20.32 67.31,24.45 v67.15,24.61
N$13
  Top 0.305: B_NEG.P$2 63.47,26 68.9,31.43 68.9,34.29 67.94,35.24 66.15,35.24 IC4.2
N$14
  Top 0.305: B_1_N.+ 67.73,26.77 69.22,28.26 70.02,28.26 R8.1 72.27,30 B_1_P.-
N$15
  Top 0.305: B_2_N.+ 67.73,7.41 68.58,8.26 70.02,8.26 R9.1 72.27,10 B_2_P.-
N$16  (via drill 0.3)
  Top 0.305: B_2_P.+ B_2_N.- 69.82,6 67.94,4.13 66.99,4.13 65.72,5.4 65.72,9.21 64.77,10.16 | 64.77,10.16 64.45,10.48 62.23,10.48 61.28,11.43 IC1.6 | v65.41,19.68 64.45,18.73 64.45,18.41 65.09,17.78 70.48,17.78 71.75,16.51 71.75,15.56 71.44,15.24 71.44,14.92 70.8,14.29 67.63,14.29 64.77,11.43 64.77,10.16 | v61.91,22.86 60.96,23.81 60.64,23.81 60.33,24.13 v60.33,26.04 | v58.42,27.94 58.42,35.24 60.64,35.24 IC4.7
  Bottom 0.305: v65.41,19.68 63.5,21.59 63.18,21.59 v61.91,22.86 | v58.42,27.94 v60.33,26.04
N$17
  Top 0.305: D2.2 8.39,31.39 J4.2 J4.1
N$18  (via drill 0.3)
  Top 0.305: v65.72,39.37 66.04,39.05 68.9,39.05 74.61,44.77 91.12,44.77 99.06,36.83 99.06,11.43 88.9,1.27 64.14,1.27 64.14,3.81 63.18,4.76 63.18,5.71 B_POS.P$2 | v64.45,38.42 63.82,37.78 60.96,37.78 IC4.5
  Bottom 0.305: v65.72,39.37 64.77,38.42 v64.45,38.42
N$19
  Top 0.305: IC5.1 94.04,32.13 92.08,30.16 92.08,25.4 90.81,24.13 89.6,24.13 A_1_P.+ A_1_N.- 84.27,23.31 82.23,21.27 58.1,21.27 57.47,20.64 IC1.12
N$20
  Top 0.305: IC5.2 96.25,35.2 97.16,34.29 97.16,29.16 A_NEG.P$2
N$21
  Top 0.305: A_1_N.+ 81.6,26.13 81.6,28.89 82.7,30 R16.1 87.61,27.62 88.58,27.62 90.2,26 A_1_P.-
N$22
  Top 0.305: R17.1 85.02,8.26 83.5,8.26 81.73,6.48 A_2_N.+ 83.6,4.13 88.9,4.13 90.27,5.5 A_2_P.-
N$23  (via drill 0.3)
  Top 0.305: A_2_N.- A_2_P.+ 90.17,8.44 90.17,19.68 | IC5.7 90.81,35.24 91.44,34.61 95.89,34.61 96.2,34.29 96.2,32.7 92.71,29.21 92.71,22.23 90.17,19.68 | 90.17,19.68 82.55,19.68 v81.92,20.32 | v80.01,22.23 57.15,22.23 56.2,21.27 IC1.13
  Bottom 0.305: v81.92,20.32 v80.01,22.23
N$25
  Top 0.305: A_POS.P$2 95.96,15 98.11,17.14 98.11,35.24 96.2,37.15 91.76,37.15 91.12,37.78 IC5.5
N$26  (via drill 0.3)
  Top 0.305: C_1_N.- C_1_P.+ 49.92,23.81 v50.48,23.81 | IC6.1 54.67,31.18 53.02,29.53 v53.02,25.72 | IC1.8 v62.55,20.32 | v59.69,23.18 58.1,23.18 57.78,22.86 56.52,22.86 55.56,21.91 54.29,21.91 v53.34,22.86
  Bottom 0.305: v53.02,25.72 53.02,24.77 52.23,23.97 | 52.23,23.97 52.07,23.81 v50.48,23.81 | v62.55,20.32 v59.69,23.18 | v53.34,22.86 52.23,23.97
N$27
  Top 0.305: C_NEG.P$2 56.16,26 57.78,27.62 57.78,33.97 56.56,35.2 IC6.2
N$28
  Top 0.305: C_1_N.+ 41.73,26.49 43.5,28.26 46.02,28.26 R20.1 47.76,28.51 C_1_P.-
N$29
  Top 0.305: C_2_N.+ 41.73,8.07 43.5,9.84 46.08,9.84 R21.1 50.24,6 C_2_P.-
N$30  (via drill 0.3)
  Top 0.305: v49.85,3.81 47.73,5.93 C_2_P.+ C_2_N.- 43.81,6.46 v43.81,8.57 | v49.85,1.27 52.7,1.27 53.34,0.64 57.15,0.64 58.74,2.22 v58.74,10.16 | v61.28,15.56 IC1.9 | IC6.7 47.26,35.2 v38.73,26.67 | v39.69,25.08 36.83,22.23 36.83,19.05 v43.81,12.06
  Bottom 0.305: v49.85,3.81 v49.85,1.27 | 60.96,15.24 v61.28,15.56 58.74,13.02 v58.74,10.16 | v38.73,26.67 38.73,26.04 v39.69,25.08 | v43.81,12.06 v43.81,8.57
N$32  (via drill 0.3)
  Top 0.305: C_POS.P$2 54.96,6 50.8,10.16 50.8,12.06 50.16,12.7 50.16,19.68 50.48,20 50.48,21.59 51.75,22.86 51.75,28.26 50.16,29.84 50.16,30.8 v48.9,32.07 | v48.9,39.37 48.9,38.31 IC6.5
  Bottom 0.305: v48.9,32.07 v48.9,39.37
N$33
  Top 0.305: R22.1 71.76,14.49 B_S.-
N$34
  Top 0.305: R23.1 86.76,15.49 A_S.-
N$35
  Top 0.305: R24.1 46.24,14.97 C_S.-
N$36  (via drill 0.3)
  Top 0.305: B_S.+ 68.39,16 v63.82,11.43 | v60.33,10.79 59.37,10.79 58.74,11.43 IC1.4
  Bottom 0.305: v63.82,11.43 60.96,11.43 v60.33,10.79
N$37  (via drill 0.3)
  Top 0.305: A_S.+ 84.73,17.5 83.19,19.05 66.04,19.05 v65.41,18.41 | v58.74,16.83 IC1.11
  Bottom 0.305: v65.41,18.41 60.33,18.41 v58.74,16.83
N$38  (via drill 0.3)
  Top 0.305: C_S.+ 44.73,16.79 46.04,18.1 v48.9,18.1 | v51.75,18.1 51.75,15.88 51.44,15.56 51.44,13.97 52.07,13.34 53.34,13.34 54.61,14.61 58.1,14.61 60.01,16.51 IC1.10
  Bottom 0.305: v48.9,18.1 v51.75,18.1
REF_-5V
  Top 0.305: U2.2 24.21,42.42 C16.2 22.86,40.64 21.59,39.37 R26.2 19.18,37.47 R15.1